# Altium schematic sheet Sheet1.SchDoc
size A2
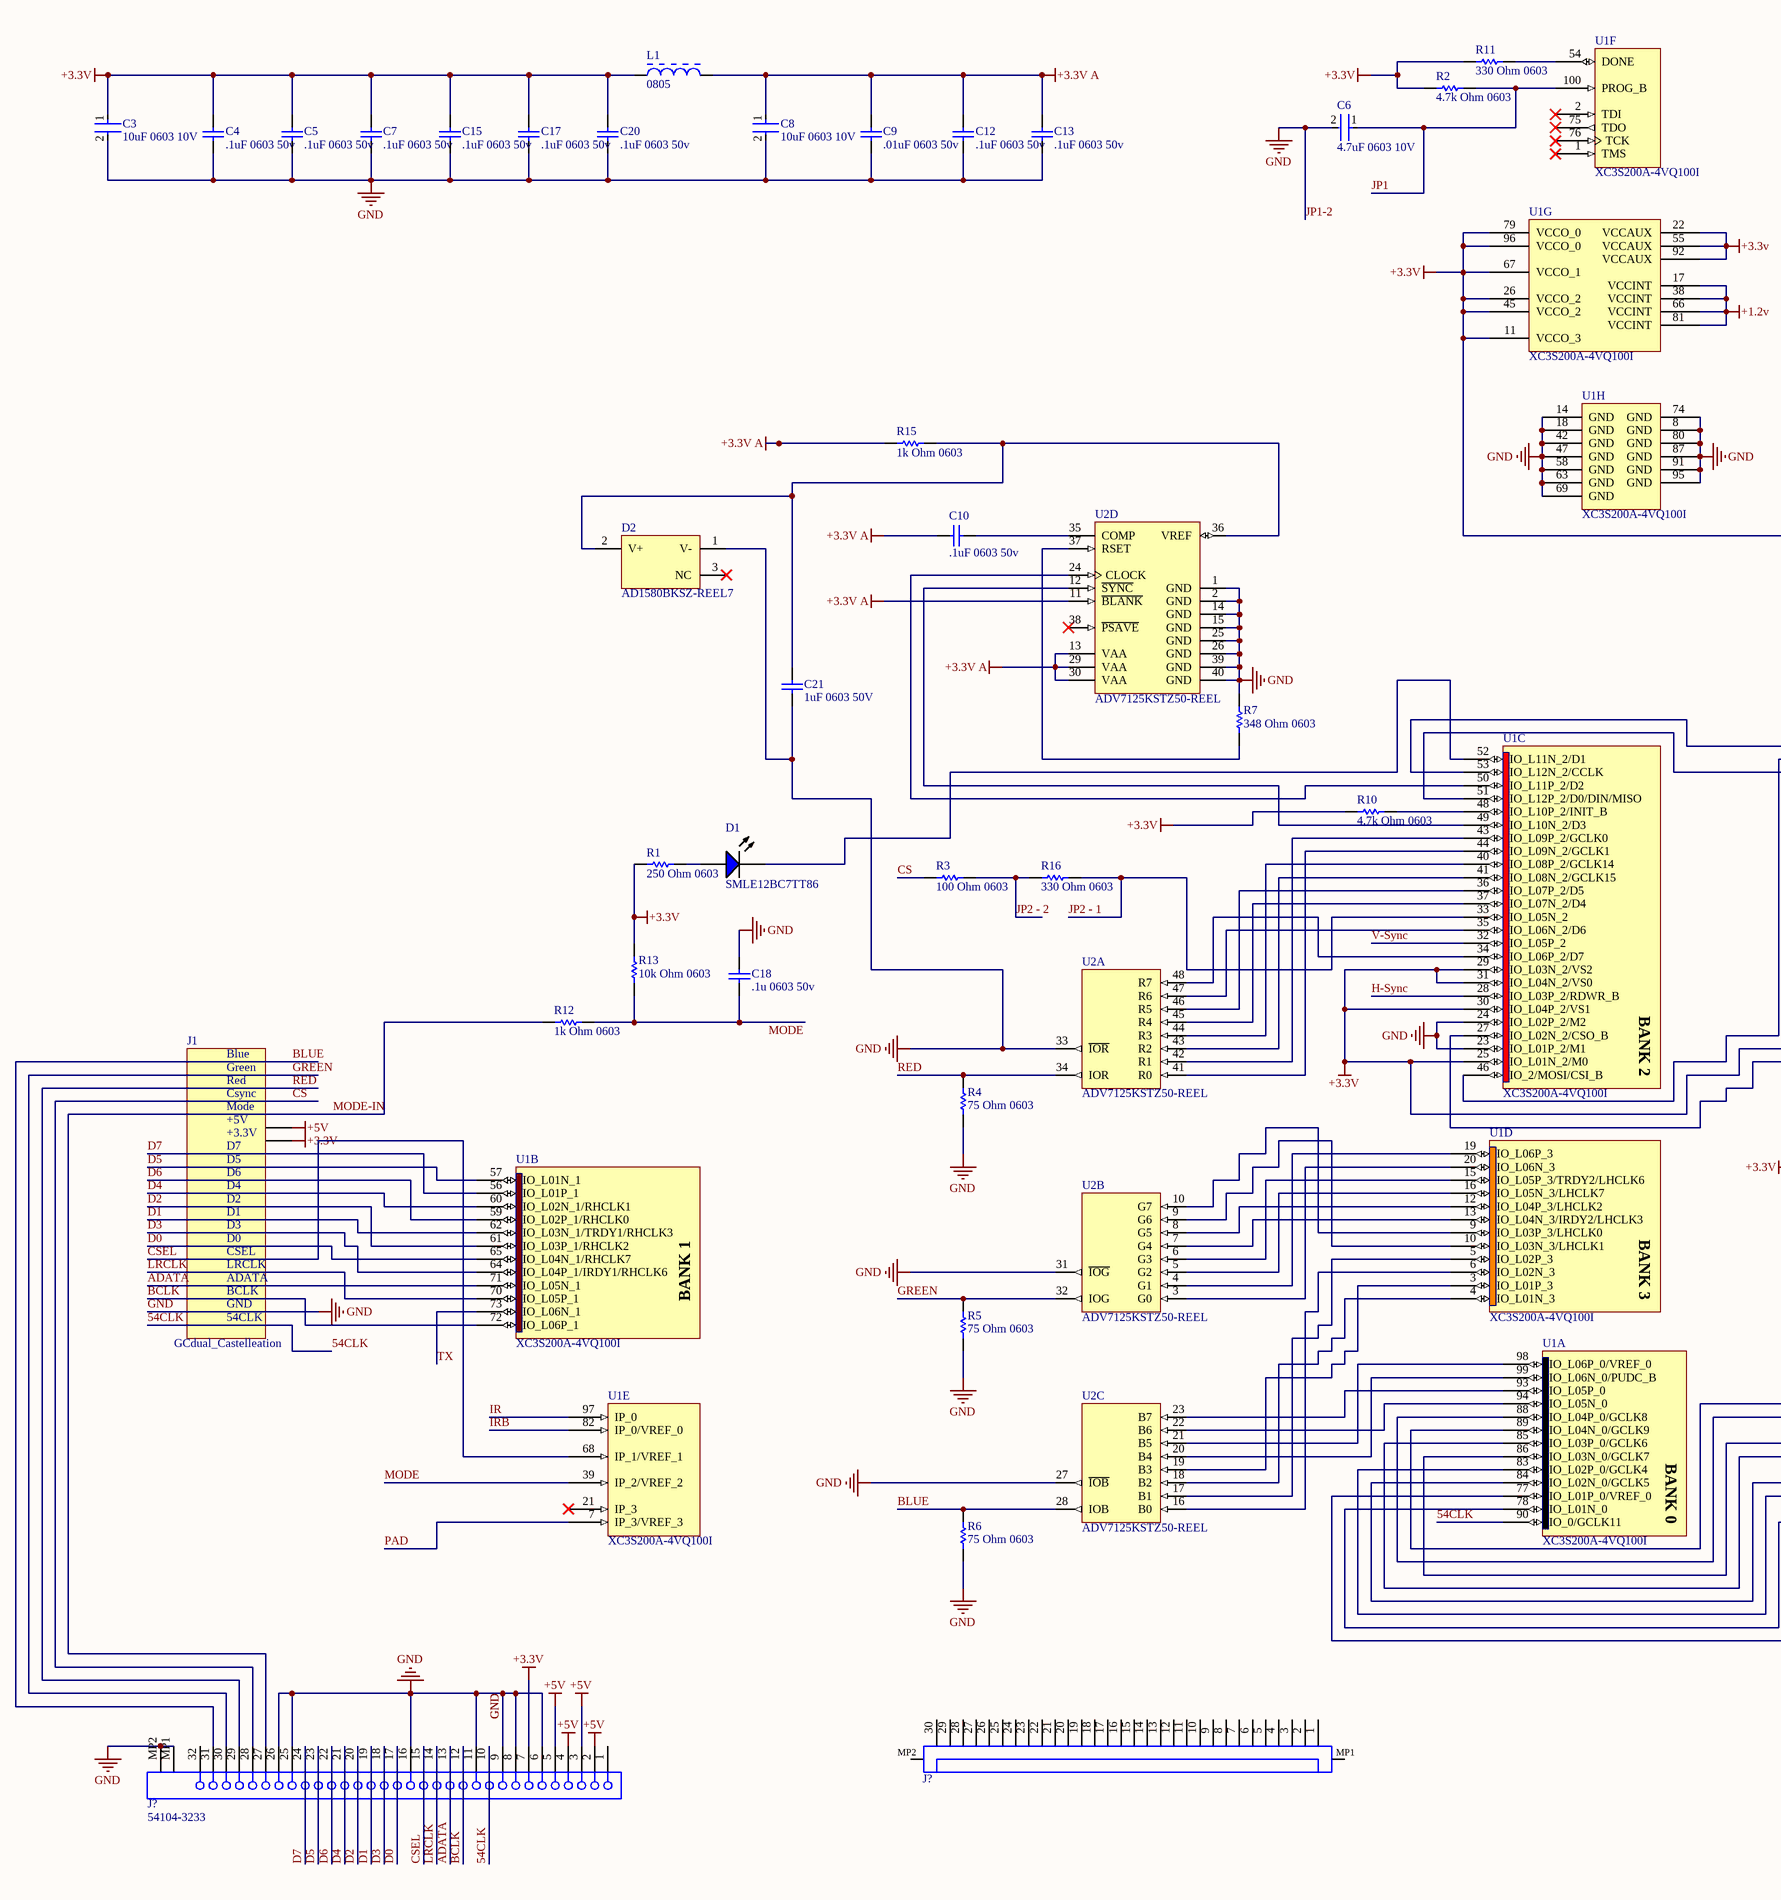
[diagram p0: Sheet1.SchDoc, left]
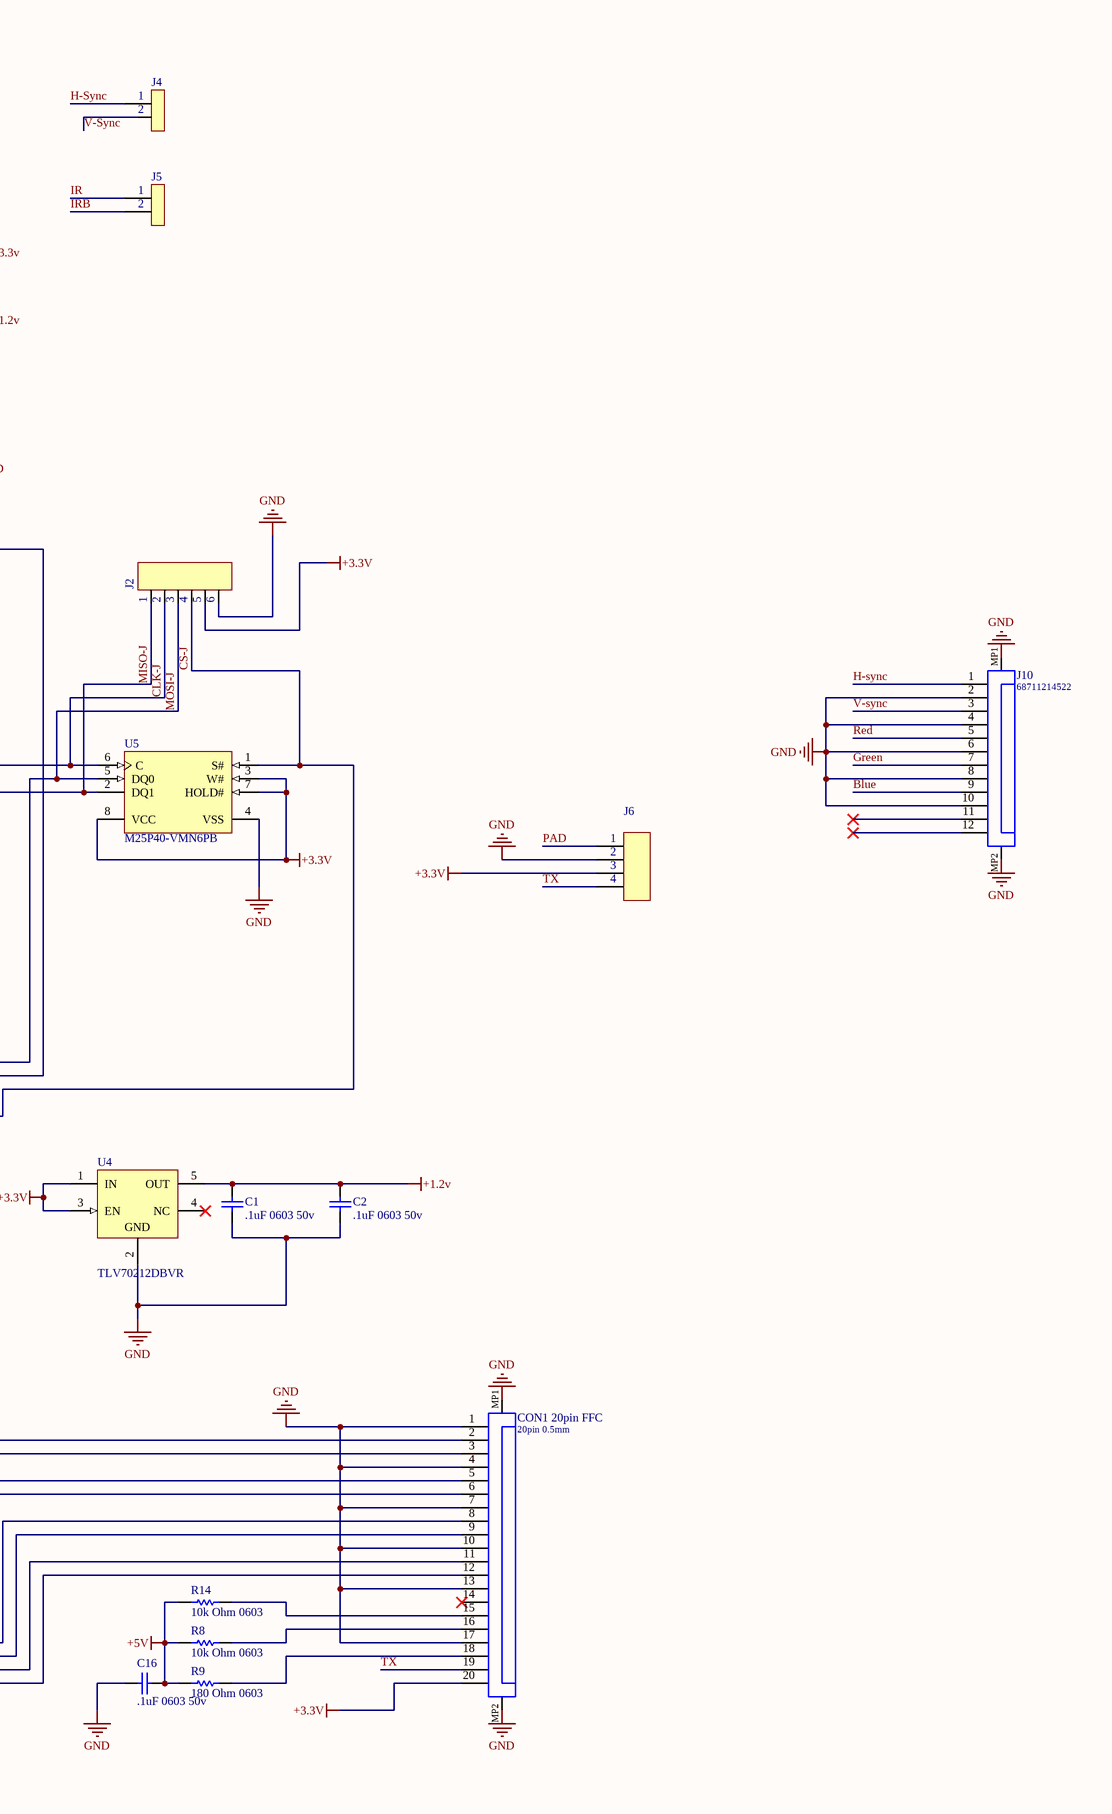
[diagram p1: Sheet1.SchDoc, right]

## Parts
(Parts that share a designator on the sheet are numbered #1, #2 ... from top to bottom, then left to right.)
C1  .1uF 0603 50v  [CAPC1608X90X35LL15T15]
C2  .1uF 0603 50v  [CAPC1608X90X35LL15T15]
C3  10uF 0603 10V  [FP-C1608-080-MFG]
C4  .1uF 0603 50v  [CAPC1608X90X35LL15T15]
C5  .1uF 0603 50v  [CAPC1608X90X35LL15T15]
C6  4.7uF 0603 10V  [FP-CL10-IPC_C]
C7  .1uF 0603 50v  [CAPC1608X90X35LL15T15]
C8  10uF 0603 10V  [FP-C1608-080-MFG]
C9  .01uF 0603 50v  [CAPC1608X90X35ML10T15]
C10  .1uF 0603 50v  [CAPC1608X90X35LL15T15]
C12  .1uF 0603 50v  [CAPC1608X90X35LL15T15]
C13  .1uF 0603 50v  [CAPC1608X90X35LL15T15]
C15  .1uF 0603 50v  [CAPC1608X90X35LL15T15]
C16  .1uF 0603 50v  [CAPC1608X90X35LL15T15]
C17  .1uF 0603 50v  [CAPC1608X90X35LL15T15]
C18  .1u 0603 50v  [CAPC1608X90X35LL15T15]
C20  .1uF 0603 50v  [CAPC1608X90X35LL15T15]
C21  1uF 0603 50V  [CAPC1608X90X20LL10]
CON1_20pin_FFC  20pin 0.5mm  [68712014022]
D1  SMLE12BC7TT86  [ROHM-SMLE12BC7TT86_V]
D2  AD1580BKSZ-REEL7  [ADI-KS-3_N]
J10  68711214522  [68711214522]
J?#1  (no value)  [687130149022]
J?#2  54104-3233  [MOLX-54104-3233]
L1  0805  [MURA-BLM21-H1-CHIP-2_V]
R1  250 Ohm 0603  [RESC1608X55X25ML10T15]
R2  4.7k Ohm 0603  [RESC1608X55X25LL10T15]
R3  100 Ohm 0603  [RESC1609X50X30ML8T20]
R4  75 Ohm 0603  [RESC1609X50X30ML8T20]
R5  75 Ohm 0603  [RESC1609X50X30ML8T20]
R6  75 Ohm 0603  [RESC1609X50X30ML8T20]
R7  348 Ohm 0603  [RESC1609X50X30ML8T20]
R8  10k Ohm 0603  [RESC1609X50X30ML8T20]
R9  180 Ohm 0603  [RESC1609X50X30ML8T20]
R10  4.7k Ohm 0603  [RESC1608X55X25LL10T15]
R11  330 Ohm 0603  [RESC1609X50X30ML8T20]
R12  1k Ohm 0603  [RESC1609X50X30ML8T20]
R13  10k Ohm 0603  [RESC1609X50X30ML8T20]
R14  10k Ohm 0603  [RESC1609X50X30ML8T20]
R15  1k Ohm 0603  [RESC1609X50X30ML8T20]
R16  330 Ohm 0603  [RESC1609X50X30ML8T20]
U1  XC3S200A-4VQ100I  [VQ100_M]  (parts A,B,C,D,E,F,G,H of 8)
U2  ADV7125KSTZ50-REEL  [ST-48_L]  (parts A,B,C,D of 4)
U4  TLV70212DBVR  [DBV0005A_N]
U5  M25P40-VMN6PB  [MICT-MN-8_N]

## Nets
+1.2v: C1.2 C2.2 U1.17(VCCINT) U1.38(VCCINT) U1.66(VCCINT) U1.81(VCCINT) U4.5(OUT)
+3.3V: C3.1 C4.1 C5.2 C7.2 C15.1 C17.2 C20.2 CON1_20pin_FFC.20 J?#2.7 L1.1 R1.1 R2.1 R10.1 R11.1 R13.2 U1.11(VCCO_3) U1.22(VCCAUX) U1.25(IO_L01N_2/M0) U1.26(VCCO_2) U1.29(IO_L03N_2/VS2) U1.30(IO_L04P_2/VS1) U1.31(IO_L04N_2/VS0) U1.45(VCCO_2) U1.55(VCCAUX) U1.67(VCCO_1) U1.79(VCCO_0) U1.92(VCCAUX) U1.96(VCCO_0) U4.1(IN) U4.3(EN) U5.3(W#) U5.7(HOLD#) U5.8(VCC)
+3.3V A: C8.1 C9.2 C10.1 C12.2 C13.2 L1.2 R15.1 U2.11(~{BLANK}) U2.13(VAA) U2.29(VAA) U2.30(VAA)
+5V: C16.1 J?#2.2 J?#2.3 J?#2.4 J?#2.5 R8.1 R9.1 R14.1
GND: C1.1 C2.1 C3.2 C4.2 C5.1 C6.2 C7.1 C8.2 C9.1 C12.1 C13.1 C15.2 C16.2 C17.1 C18.2 C20.1 C21.1 CON1_20pin_FFC.1 CON1_20pin_FFC.4 CON1_20pin_FFC.7 CON1_20pin_FFC.10 CON1_20pin_FFC.13 CON1_20pin_FFC.17 CON1_20pin_FFC.MP1 CON1_20pin_FFC.MP2 D2.1(V-) J10.2 J10.4 J10.6 J10.8 J10.10 J10.MP1 J10.MP2 J?#2.6 J?#2.8 J?#2.9 J?#2.11 J?#2.16 J?#2.25 J?#2.26 J?#2.MP1 J?#2.MP2 R4.1 R5.2 R6.1 R7.2 U1.8(GND) U1.14(GND) U1.18(GND) U1.23(IO_L01P_2/M1) U1.24(IO_L02P_2/M2) U1.42(GND) U1.47(GND) U1.58(GND) U1.63(GND) U1.69(GND) U1.74(GND) U1.80(GND) U1.87(GND) U1.91(GND) U1.95(GND) U2.1(GND) U2.2(GND) U2.14(GND) U2.15(GND) U2.25(GND) U2.26(GND) U2.27(~{IOB}) U2.31(~{IOG}) U2.33(~{IOR}) U2.39(GND) U2.40(GND) U4.2(GND) U5.4(VSS)  [also labelled JP1-2]
54CLK: J?#2.10 U1.90(IO_0/GCLK11)
ADATA: J?#2.13 U1.71(IO_L05N_1)
BCLK: J?#2.12 U1.72(IO_L06P_1)
BLUE: J10.9 J?#2.31 R6.2 U2.28(IOB)
CLK-J: U1.53(IO_L12N_2/CCLK) U5.6(C)
CS: J?#2.28 R3.1
CS-J: U1.27(IO_L02N_2/CSO_B) U5.1(S#)
CSEL: J?#2.15 U1.68(IP_1/VREF_1)
D0: J?#2.17 U1.65(IO_L04N_1/RHCLK7)
D1: J?#2.19 U1.62(IO_L03N_1/TRDY1/RHCLK3)
D2: J?#2.20 U1.61(IO_L03P_1/RHCLK2)
D3: J?#2.18 U1.64(IO_L04P_1/IRDY1/RHCLK6)
D4: J?#2.21 U1.60(IO_L02N_1/RHCLK1)
D5: J?#2.23 U1.57(IO_L01N_1)
D6: J?#2.22 U1.59(IO_L02P_1/RHCLK0)
D7: J?#2.24 U1.56(IO_L01P_1)
GREEN: J10.7 J?#2.30 R5.1 U2.32(IOG)
H-Sync: J10.1 U1.28(IO_L03P_2/RDWR_B)
IR: U1.97(IP_0)
IRB: U1.82(IP_0/VREF_0)
JP1: C6.1 R2.2 U1.100(PROG_B)
JP2 - 1: R16.2 U1.33(IO_L05N_2)
JP2 - 2: R3.2 R16.1
LRCLK: J?#2.14 U1.70(IO_L05P_1)
MISO-J: U1.51(IO_L12P_2/D0/DIN/MISO) U5.2(DQ1)
MODE: C18.1 R12.2 R13.1 U1.39(IP_2/VREF_2)
MODE-IN: J?#2.27 R12.1
MOSI-J: U1.46(IO_2/MOSI/CSI_B) U5.5(DQ0)
PAD: U1.7(IP_3/VREF_3)
RED: J10.5 J?#2.29 R4.2 U2.34(IOR)
TX: CON1_20pin_FFC.19 U1.73(IO_L06N_1)
V-Sync: J10.3 U1.32(IO_L05P_2)
NetC10_2: C10.2 U2.35(COMP)
NetC21_2: C21.2 D2.2(V+) R15.2 U2.36(VREF)
NetCON1_20pin_FFC_2: CON1_20pin_FFC.2 U1.89(IO_L04N_0/GCLK9)
NetCON1_20pin_FFC_3: CON1_20pin_FFC.3 U1.88(IO_L04P_0/GCLK8)
NetCON1_20pin_FFC_5: CON1_20pin_FFC.5 U1.86(IO_L03N_0/GCLK7)
NetCON1_20pin_FFC_6: CON1_20pin_FFC.6 U1.85(IO_L03P_0/GCLK6)
NetCON1_20pin_FFC_8: CON1_20pin_FFC.8 U1.84(IO_L02N_0/GCLK5)
NetCON1_20pin_FFC_9: CON1_20pin_FFC.9 U1.83(IO_L02P_0/GCLK4)
NetCON1_20pin_FFC_11: CON1_20pin_FFC.11 U1.78(IO_L01N_0)
NetCON1_20pin_FFC_12: CON1_20pin_FFC.12 U1.77(IO_L01P_0/VREF_0)
NetCON1_20pin_FFC_15: CON1_20pin_FFC.15 R14.2
NetCON1_20pin_FFC_16: CON1_20pin_FFC.16 R8.2
NetCON1_20pin_FFC_18: CON1_20pin_FFC.18 R9.2
NetD1_1: D1.1(A) R1.2
NetD1_2: D1.2(K) U1.52(IO_L11N_2/D1)
NetR7_1: R7.1 U2.37(RSET)
NetR10_2: R10.2 U1.48(IO_L10P_2/INIT_B)
NetR11_2: R11.2 U1.54(DONE)
NetU1_3: U1.3(IO_L01P_3) U2.19(B3)
NetU1_4: U1.4(IO_L01N_3) U2.18(B2)
NetU1_5: U1.5(IO_L02P_3) U2.17(B1)
NetU1_6: U1.6(IO_L02N_3) U2.16(B0)
NetU1_9: U1.9(IO_L03P_3/LHCLK0) U2.10(G7)
NetU1_10: U1.10(IO_L03N_3/LHCLK1) U2.9(G6)
NetU1_12: U1.12(IO_L04P_3/LHCLK2) U2.8(G5)
NetU1_13: U1.13(IO_L04N_3/IRDY2/LHCLK3) U2.7(G4)
NetU1_15: U1.15(IO_L05P_3/TRDY2/LHCLK6) U2.6(G3)
NetU1_16: U1.16(IO_L05N_3/LHCLK7) U2.5(G2)
NetU1_19: U1.19(IO_L06P_3) U2.4(G1)
NetU1_20: U1.20(IO_L06N_3) U2.3(G0)
NetU1_34: U1.34(IO_L06P_2/D7) U2.48(R7)
NetU1_35: U1.35(IO_L06N_2/D6) U2.47(R6)
NetU1_36: U1.36(IO_L07P_2/D5) U2.46(R5)
NetU1_37: U1.37(IO_L07N_2/D4) U2.45(R4)
NetU1_40: U1.40(IO_L08P_2/GCLK14) U2.44(R3)
NetU1_41: U1.41(IO_L08N_2/GCLK15) U2.43(R2)
NetU1_43: U1.43(IO_L09P_2/GCLK0) U2.42(R1)
NetU1_44: U1.44(IO_L09N_2/GCLK1) U2.41(R0)
NetU1_49: U1.49(IO_L10N_2/D3) U2.12(~{SYNC})
NetU1_50: U1.50(IO_L11P_2/D2) U2.24(CLOCK)
NetU1_93: U1.93(IO_L05P_0) U2.23(B7)
NetU1_94: U1.94(IO_L05N_0) U2.22(B6)
NetU1_98: U1.98(IO_L06P_0/VREF_0) U2.21(B5)
NetU1_99: U1.99(IO_L06N_0/PUDC_B) U2.20(B4)

Not connected (* = marked no-connect by the designer): CON1_20pin_FFC 14*; D2 3(NC)*; J10 11* 12*; J?#1 1 2 3 4 5 6 7 8 9 10 11 12 13 14 15 16 17 18 19 20 21 22 23 24 25 26 27 28 29 30 MP1 MP2; J?#2 1 32; U1 1(TMS)* 2(TDI)* 21(IP_3)* 75(TDO)* 76(TCK)*; U2 38(~{PSAVE})*; U4 4(NC)*

## Notes on the sheet
- 1
- J4
- 2
- J5
- J2
- 3
- 4
- 5
- 6
- J6
- J1
- Blue
- Green
- Red
- Csync
- Mode
- +5V
- +3.3V
- D7
- D5
- D6
- D4
- D2
- D1
- D3
- D0
- CSEL
- LRCLK
- ADATA
- GCdual_Castelleation
- BCLK
- GND
- 54CLK
- Labels drawn without touching a wire or pin: +3.3V, +5V
- (in symbol CMP-0049-00089-1, part A) BANK 0
- (in symbol CMP-0049-00089-1, part B) BANK 1
- (in symbol CMP-0049-00089-1, part C) BANK 2
- (in symbol CMP-0049-00089-1, part D) BANK 3

## Library data of the parts
C1 C2 C4 C5 C7 C10 C12 C13 C15-C18 C20 = CMP-2006-04532-1: Manufacturer: AVX Interconnect / Elco; Part Number: 0603YD105KAT2A
C3 C8 = CMP-2000-04979-2: CAP CER 10UF 10V X5R 0603; Manufacturer Part Number: C1608X5R1A106K080AC; Manufacturer: TDK; Temperature Coefficient: 15%; Tolerance: 10%; Material: Ceramic; Mouser Description: CAP CER 10UF 10V X5R 0603; Package: C1608-080; Lead Free: Yes; Device Class L1: Passive Components; Value: 10uF; Temperature Range High: +85°C; Octopart: https://octopart.com/c1608x5r1a106k080ac-tdk-26013468; Voltage: 10V; Footprint Url: https://product.tdk.com/info/en/catalog/spec/mlccspec_commercial_general_midvoltage_en.pdf; Ipc Land Pattern Name: CAPC16080X80; Temperature Range Low: -55°C; Temperature: -55°C to +85°C; ComponentLink2Description: Datasheet; ComponentLink2URL: https://product.tdk.com/info/en/documents/chara_sheet/C1608X5R1A106K080AC.pdf; Height: 0.9mm; Temperature Characteristic: X5R; RoHS: TRUE; Category: Cap; Capacitance: 10uF; Digikey Description: CAP CER 10UF 10V X5R 0603; Automotive: No; Device Class L3: Ceramic Capacitors; Device Class L2: Capacitors; Voltage Rating: 10V
C6 = CMP-13271-003017-1: Cap Ceramic 4.7uF 10V X5R ±10% Pad SMD 0603 +85°C T/R; Capacitance: 4.7uF; Case/Package: 0603; Packaging: Tape and Reel; Width: 0.031inch; Contact Plating: Tin; Thickness: 0.035inch; Package Quantity: 1; Voltage Rating: 10V; Case Code (Metric): 1608; Case Code (Imperial): 0603; Depth: 0.8mm; Height: 0.8mm; Tolerance: 10%; Max Operating Temperature: 85°C; Length: 1.6mm; Dielectric: X5R; Mount: Surface Mount; Radiation Hardening: No; Min Operating Temperature: -55°C
C9 = CMP-2100-03642-1: Chip Capacitor, 10 nF, +/- 10%, 50 V, -55 to 125 degC, 0603 (1608 Metric), RoHS, Tape and Reel; Manufacturer: Murata; Insulation Resistance: 10GR; Dielectric: X7R; Capacitance: 10nF; Material: Ceramic; Package Quantity: 1; Lead Free: LeadFree; Voltage Rating: 50V; Case/Package: 0603; Termination: SMD/SMT; REACH SVHC: Unknown; Manufacturer URL: http://www.murata.com/; Datasheet URL: http://search.murata.co.jp/Ceramy/image/img/A01X/G101/ENG/GRM188R71H103KA01-01.pdf; Mount: SurfaceMount; Datasheet Version: 42401.0; Number of Pins: 2; Length: 1.6mm; Voltage: 50V; Depth: 0.8mm; Tolerance: 10%; Min Operating Temperature: -55degC; Voltage Rating (DC): 50V; Max Operating Temperature: 125degC; Package Description: 2-Pin Surface Mount Device, Body 1.6 x 0.8 mm; RoHSCompliant: True; Case Code (Imperial): 0603; Width: 0.031inch; Case Code (Metric): 1608; Height: 0.8mm; Package Reference: 0603; Packaging: TapeandReel; Thickness: 0.035inch; Dielectric Material: Ceramic
C21 = CMP-2000-06025-1: Chip Capacitor, 1 uF, +/- 10%, 50 V, -55 to 85 degC, 0603 (1608 Metric), RoHS, Tape and Reel; Manufacturer: TDK; PCN Part Number: MLCCPartNumberChange30/Nov/2012; Other Names: 445-7468-6; Online Catalog: CSeries,GeneralPurpose; Capacitance: 1µF; Product Training Modules: CSeriesGeneralApplicationsSEAT,CCV,andTVCLDesignToolsGuidetoReplacinganElectrolyticCapacitorwithanMLCC; Design Resources: 20WNon-IsolatedBuckLEDDriverUsingPLLNK460KG; Temperature Coefficient: X5R; Series: C; Datasheet Version: 08/2016; Package Description: 2-Pin Surface Mount Device, Body 1.6 x 0.8 mm; Mounting Technology: SurfaceMount; Features: -; Size / Dimension: 0.063"Lx0.031"W(1.60mmx0.80mm); Lead Spacing: -; Operating Temperature: -55°C~85°C; Tolerance: ±10%; Height - Seated (Max): -; Mounting Type: SurfaceMount,MLCC; Ratings: -; Voltage - Rated: 50V; Standard Package: 1; Applications: GeneralPurpose; Datasheet URL: https://product.tdk.com/info/en/catalog/datasheets/mlcc_commercial_general_en.pdf; Category: Capacitors; Lead Style: -; Packaging: Digi-Reel®; RoHS Information: RoHSCertificate-MLCC; Package / Case: 0603(1608Metric); Package Reference: 0603; Manufacturer URL: http://www.tdk.com/; Thickness (Max): 0.035"(0.90mm); Family: CeramicCapacitors
CON1_20pin_FFC = CMP-1502-01556-1: SMT ZIF Connectors WR-FPC, Horizontal, Top Contact, pitch 0.5 mm, 20 pins; Manufacturer: Wurth Elektronik; Working Voltage: 50VAC; Rated Current: 0.5A; Contact Resistance: 20mOhm; Withstanding Voltage: 250VAC; Pin Number: 20; Mounting Technology: SMT; Contact Design: TopContact; Pitch: 0.5mm; Packaging: TapeandReel; Operating Temperature: -25to85degC; Package Reference: 68712014022; Part Number: 68712014022; Datasheet URL: https://katalog.we-online.de/em/datasheet/68712014022.pdf; Manufacturer URL: http://www.we-online.de; Orientation: Horizontal; Publisher: WurthElektronik
D1 = CMP-2000-07118-1: Blue LED, 2.9 V, 20 mA, -30 to 85 degC, 2-Pin SMD, RoHS, Tape and Reel; Manufacturer: Rohm; Lens Type: Clear; Viewing Angle: 140°; Forward Voltage: 2.9V; Forward (Drive) Current: 20mA; Intensity: 22mcd; Datasheet Version: Rev. 2.0, 03/2010; Package Description: 2-Pin Surface Mount Device, Body 1.6 x 0.8 mm; Mounting Technology: SurfaceMount; Dimension: 1.6x0.8x0.36mm; Package Reference: 1608; Datasheet URL: https://datasheet.ciiva.com/11773/0900766b80df3ad8-11773825.pdf; Color: Blue; Manufacturer URL: http://www.rohm.com/web/global/
D2 = CMP-0784-00003-1: 1.2 V Micropower, Precision Shunt Voltage Reference, 1.225 V Output, Industrial, 3-pin SOT23 (KS-3), Reel; Manufacturer: Analog Devices; Vout: 1.225V; Ref Out TC (ppm/C): 50; PackageDescription: 3-Pin Thin Shrink Small Outline Transistor Package, Body 2 x 1.25 mm, Pitch 0.65 mm; ComponentLink3Description: Package Specification; ComponentLink1Description: Manufacturer URL; DatasheetVersion: Rev. F; Operating Temp Range: -40 to 85 degC; PackageVersion: 072809-A, 07/2009; PackageReference: KS-3; ComponentLink3URL: http:/www.analog.com/static/imported-files/packages/PKG_PDF/SC70(KS)/KS_3.pdf; Packing: Reel; ComponentLink2URL: http://www.analog.com/static/imported-files/data_sheets/AD1580.pdf; ComponentLink2Description: Datasheet; ComponentLink1URL: http://www.analog.com/en/index.html; ComponentLink4Description: URL Link1; PartNumber: AD1580BKSZ-REEL7; ComponentLink4URL: Product URL:http://www.analog.com/en/special-linear-functions/voltage-references/ad1580/products/product.html; Mounting Technology: Surface Mount
J10 = CMP-1502-01530-1: SMT ZIF Connectors WR-FPC, Horizontal, Bottom Contact, pitch 0.5 mm, 12 pins; Manufacturer: Wurth Elektronik; Rated Current: 0.5A; Working Voltage: 50VAC; Withstanding Voltage: 250VAC; Pin Number: 12; Contact Resistance: 20mOhm; Pitch: 0.5mm; Orientation: Horizontal; Packaging: TapeandReel; Contact Design: BottomContact; Package Reference: 68711214522; Part Number: 68711214522; Operating Temperature: -25to85degC; Mounting Technology: SMT; Publisher: WurthElektronik; Datasheet URL: https://katalog.we-online.de/em/datasheet/68711214522.pdf; Manufacturer URL: http://www.we-online.de
J?#1 = CMP-1502-01636-1: SMT ZIF Connectors Hinge Type WR-FPC, Horizontal, Bottom Contact, pitch 0.5 mm, 30 pins; Manufacturer: Wurth Elektronik; Pitch: 0.5mm; Contact Resistance: 50mOhm; Withstanding Voltage: 150VAC; Working Voltage: 50VAC; Pin Number: 30; Rated Current: 0.5A; Package Reference: 687130149022; Operating Temperature: -40to105degC; Part Number: 687130149022; Contact Design: BottomContact; Publisher: WurthElektronik; Manufacturer URL: http://www.we-online.de; Mounting Technology: SMT; Datasheet URL: https://katalog.we-online.de/em/datasheet/687130149022.pdf; Orientation: Horizontal; Packaging: TapeandReel
J?#2 = CMP-1241-00497-1: 0.5 mm Pitch Easy-On(TM) Type FPC Connector, 2.0 mm Mated Height, Right Angle, ZIF, SMT, Top Contact, 32 Circuits, -40 to 85 degC, ELV and RoHS Compliant, Tape and Reel; Manufacturer: Molex; Pitch - Mating Interface: 0.50mm; Current (Max per Contact): 0.5A; Entry Angle: 90degrees Angle; Material - Plating Termination: Silver, Tin-Bismuth; Circuits (Loaded): 32; Stackable: No; Durability (mating cycles max): 20; Voltage (Max): 50V; Mated Height: 2.00mm; Material - Metal: Phosphor Bronze; PCB Retention: None; Polarized to PCB: Yes; Contact Position: Top; Pitch - Termination Interface: 0.50mm; Number of Rows: 1; RoHS: TRUE; PackageVersion: Rev. C, 04/2014; Packing: Tape and Reel; PartNumber: 54104-3233; ComponentLink1Description: Manufacturer URL; Mounting Technology: Surface Mount; Material - Plating Mating: Silver, Tin-Bismuth; Orientation: Right Angle; ComponentLink3Description: Package Specification; PCB Locator: No; ComponentLink1URL: http://www.molex.com/molex/index.jsp; ComponentLink3URL: http://www.molex.com/pdm_docs/sd/541043233_sd.pdf; PackageReference: 54104-3233; ComponentLink2Description: Datasheet; ComponentLink2URL: http://www.molex.com/webdocs/datasheets/pdf/en-us/0541043233_FFC_FPC_CONNECTORS.pdf; PackageDescription: 32-Lead FPC Connector, Pitch 0.5 mm
L1 = CMP-0686-00716-2: Chip Ferrite Bead for General Signal lines, 120 Ohm, 800 mA, -55 to 125 degC, 2 x 1.25 x 1.05 mm SMD, Tape and Reel; PartNumber: BLM21AG121SN1D; Manufacturer: Murata; Rated Current: 800 mA; DC Resistance: 0.1 Ohm Max.; Impedance (at 100 MHz): 120 Ohm +/- 25%; DatasheetVersion: 08/2013; PackageReference: BLM21_H1050-2; ComponentLink3URL: http://www.murata.com/products/catalog/pdf/c31e.pdf; Mounting Technology: Surface Mount; Operating Temperature Range: -55 to 125 degC; ComponentLink2Description: Datasheet; ComponentLink1URL: http://www.murata.com/; ComponentLink3Description: Package Specification; Packing: Tape and Reel; ComponentLink2URL: http://www.murata.com/products/catalog/pdf/c31e.pdf; PackageDescription: 2-Pin Chip, Body 2 x 1.25 mm; ComponentLink1Description: Manufacturer URL
R1 = CMP-2100-03667-1: Chip Resistor, 0 Ohm, +/- 5%, 0.1 W, -55 to 155 degC, 0603 (1608 Metric), RoHS, Tape and Reel; Manufacturer: Yageo; Temperature Coefficient: 200ppm/degreesC; Voltage Rating: 50V; Power Rating: 100mW; Resistance: 0mOhm; Width: 0.8mm; Max Operating Temperature: 155degC; Tolerance: 5%; Package Reference: 0603; Height: 0.45mm; Depth: 0.8mm; Package Description: 2-Pin Surface Mount Device, Body 1.6 x 0.8 mm; Termination: SMD/SMT; Package Quantity: 5000; Case/Package: 0603; Case Code (Imperial): 0603; Radiation Hardening: No; Number of Pins: 2; Length: 1.6mm; Lead Free: LeadFree; Voltage Rating (DC): 50V; Military Standard: Not; Datasheet URL: http://www.yageo.com/NewPortal/yageodocoutput?fileName=/pdf/R-Chip/PYu-RC_Group_51_RoHS_L_5.pdf; Manufacturer URL: http://www.yageo.com/; Packaging: TapeandReel; Case Code (Metric): 1608; Min Operating Temperature: -55degC; Composition: ThickFilm; RoHSCompliant: true; Contact Plating: Tin; Datasheet Version: Rev. 5, 10/2016; REACH SVHC: NoSVHC
R2 R10 = CMP-2000-06942-1: Chip Resistor, 4.7 KOhm, +/- 1%, 0.1 W, -55 to 155 degC, 0603 (1608 Metric), RoHS, Tape and Reel; Manufacturer: Yageo; Power Rating: 100mW; Temperature Coefficient: 100PPM/C; Resistance: 4.7kOhms; Voltage Rating: 50V; Package Reference: 0603; Series: RC; Datasheet Version: Rev. 7, 05/2017; Packaging: Reel; Termination Style: SMD/SMT; Datasheet URL: http://www.yageo.com/documents/recent/PYu-RC_Group_51_RoHS_L_7.pdf; Manufacturer URL: http://www.yageo.com/; Package Description: 2-Pin Surface Mount Device, Body 1.6 x 0.8 mm; Case Code - mm: 1608; Case Code - in: 0603; Mounting Technology: SurfaceMount; Operating Temperature Range: -55Cto+155C; Tolerance: 1%; Product: ThickFilmResistorsGeneralPurpose
R3-R9 R11-R16 = CMP-2000-03824-5: Chip Resistor, 100 Ohm, +/- 1%, 100 mW,-55 to 155 degC, 0603 (1608 Metric), RoHS, Tape and Ree; Manufacturer: Vishay Semiconductor; ComponentLink2URL: http://www.vishay.com/docs/20035/dcrcwe3.pdf; ComponentLink1URL: http://www.vishay.com/; Mounting Technology: Surface Mount; ComponentLink1Description: Manufacturer URL; ComponentLink2Description: Datasheet; PackageDescription: 2-Pin Surface Mount Device, Body 1.575 x 0.85 mm; PackageReference: 0603; DatasheetVersion: 06/2012
U1 = CMP-0049-00089-1: Spartan-3A I/O Optimized FPGA, 68 User I/Os, 100-Pin VQFP, Standard Performance, Industrial Grade; Code_JEDEC: MS-026-AED; PackageReference: VQ100; DatasheetVersion: ver1.8, Mar-2009; PackageDescription: 100-Pin Very Thin Quad Flat Pack (VQ100); PackageVersion: ver1.2.1, Feb-2007
U2 = CMP-0318-00720-2: 3 Channel 8-Bit CMOS High Speed Video Digital-to-Analog Converter, -40 to +85 degC, ST-48, Pb-Free, Reel; Manufacturer: Analog Devices; Single Supply: No; Op Pwr Diss: 485mW; Resolution (Bits): 8; Max V+: 5.25V; # DAC Outputs: 3; ComponentLink2Description: Datasheet; RoHS: Y; RevisionNote: Component URL fixed; PackageReference: ST-48; ComponentLink1URL: http://www.analog.com/en/index.html; Packing: Reel; ComponentLink2URL: http://www.analog.com/static/imported-files/data_sheets/ADV7125.pdf; PartNumber: ADV7125KSTZ50-REEL; ComponentLink4URL: http://www.analog.com/en/digital-to-analog-converters/da-converters/adv7125/products/product.html; ComponentLink4Description: Product URL; DatasheetVersion: Rev.C; ComponentLink3Description: Package Specification; ComponentLink1Description: Manufacturer URL; ComponentLink3URL: http://www.analog.com/static/imported-files/packages/PKG_PDF/LQFP%28ST%29/ST_48.pdf; Mounting Technology: Surface Mount; Generic Part Number: ADV7125; PackageDescription: 48-Pin Thin Quad Flat Pack 0.5 mm Pitch; PackageVersion: revA
U4 = CMP-0394-00516-2: Single Output LDO, 300 mA, Fixed 1.2 V Output, 2 to 5.5 V Input, with Low IQ, 5-pin SOT-23 (DBV), -40 to 125 degC, Green (RoHS & no Sb/Br); Manufacturer: Texas Instruments; Vin(Min)(V): 2; SubFamily: Single Channel LDO; Vdo(Typ)(mV): 220; Iout(Max)(A): 0.3; Vin(Max)(V): 5.5; Fixed Output Options(V): 1.2; Iq(Typ)(mA): 0.03; ComponentLink3URL: http://www.ti.com/litv/pdf/mpds018i; PartNumber: TLV70212DBVR; ComponentLink2URL: http://www.ti.com/general/docs/lit/getliterature.tsp?genericPartNumber=TLV70212&fileType=pdf; ComponentLink2Description: Datasheet; ComponentLink1URL: http://www.ti.com/; PackageDescription: 5-Pin Plastic Small Outline, Body 1.60 Ãƒâ€” 2.90 mm, Pitch 0.95 mm; Accuracy(%): 2; DatasheetVersion: SLVSAG6B; PackageVersion: 4073253-4/K; Eco-Plan: Green (RoHS & no Sb/Br); Vout Adj(Min)(V): 1.2; PackageReference: DBV0005A; Code_JEDEC: MO-178; ComponentLink3Description: Package Specification; Vout Adj(Max)(V): 1.2; Mounting Technology: Surface Mount; ComponentLink1Description: Manufacturer URL
U5 = CMP-0357-00075-1: 4 Mb (x1) Serial NOR Flash Memory, 75 MHz, 2.3 to 3.6 V, 8-pin SO8 Narrow (MN), Tube; Manufacturer: Micron; Part Family: M25PÂ; Density: 4MbÂ; Speed: 75 MHzÂ; Voltage: 2.3V-3.6VÂ; Mounting Technology: Surface Mount; ComponentLink3URL: http://www.micron.com/~/media/Documents/Products/Data%20Sheet/NOR%20Flash/Serial%20NOR/M25P/M25P05A.pdf; Type: Data StorageÂ; ComponentLink3Description: Package Specification; ComponentLink1Description: Manufacturer URL; Package: SO8 NarrowÂ; ComponentLink2URL: http://www.micron.com/~/media/Documents/Products/Data%20Sheet/NOR%20Flash/Serial%20NOR/M25P/M25P40.pdf; RoHS: YesÂ; PartNumber: M25P40-VMN6PB; ComponentLink2Description: Datasheet; ComponentLink1URL: http://www.micron.com/; DatasheetVersion: Rev. Y; Width: x1Â; Applications: EmbeddedÂ; PackageDescription: 8-Pin SO Narrow, 3.9 X 4.9 mm, Pitch 1.27 mm; PackageVersion: Rev 11; Part Status: ProductionÂ; PackageReference: MICT-MN-8